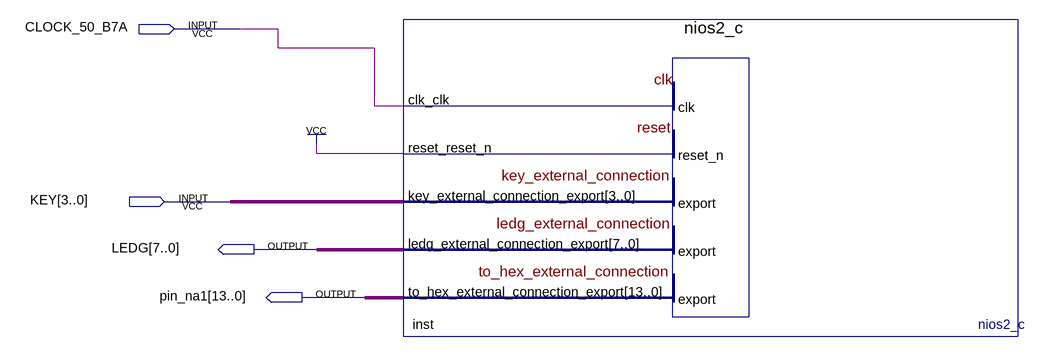
[diagram p0: schematic sheet]
// Quartus schematic top.bdf as structural Verilog: 1 symbols, 4 pins
module top (
  input  CLOCK_50_B7A,
  input  [3:0] KEY,
  output [7:0] LEDG,
  output [13:0] pin_na1
);

  nios2_c inst (
    .clk_clk(CLOCK_50_B7A), .reset_reset_n(1'b1), .key_external_connection_export(KEY),
    .ledg_external_connection_export(LEDG), .to_hex_external_connection_export(pin_na1));
endmodule
